# EAGLE schematic Shield-Proteco (EAGLE 9.1.0)
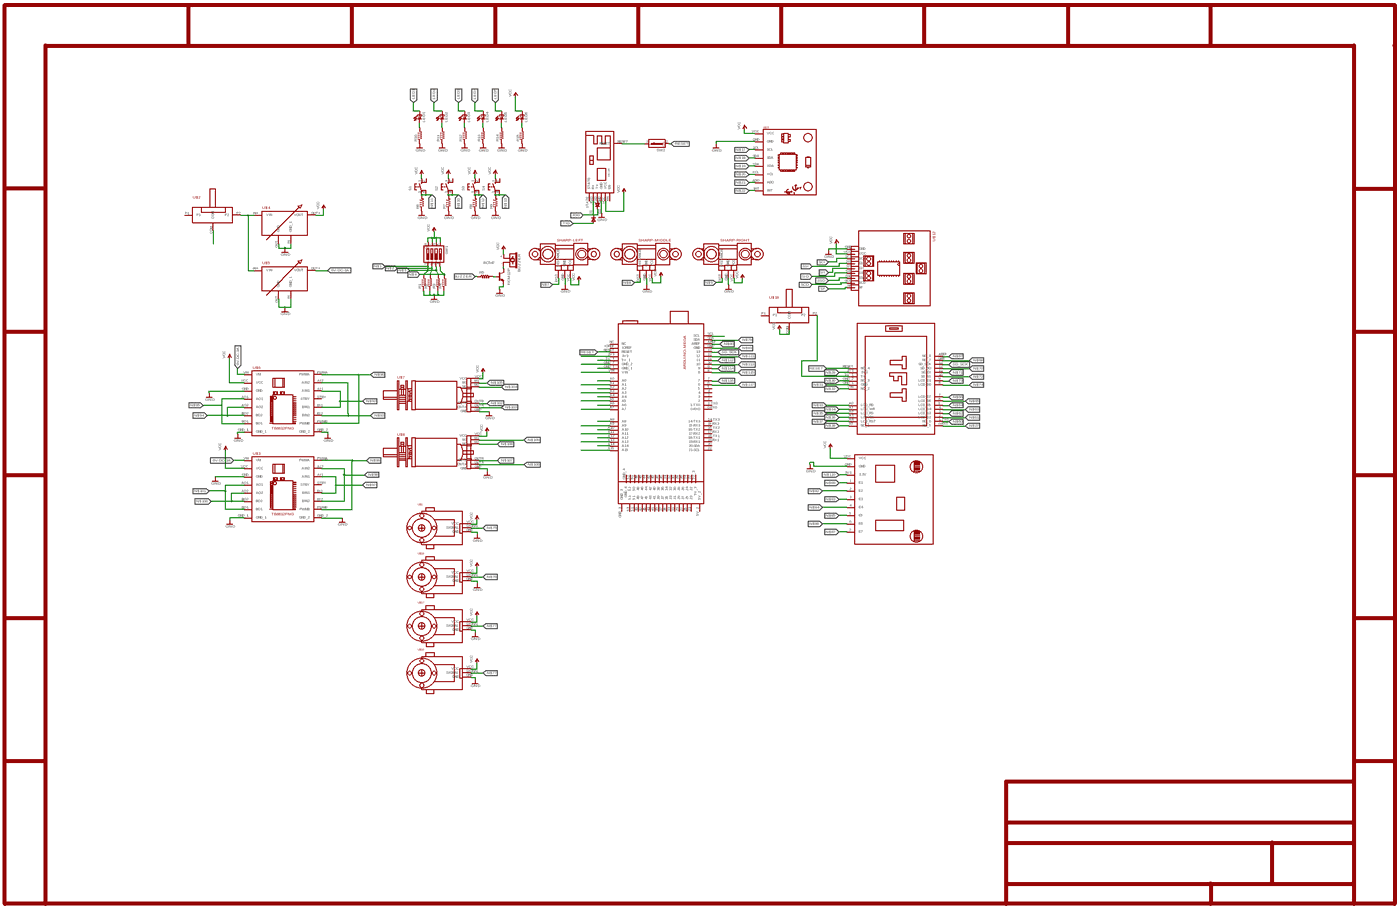
[diagram p0: schematic, sheet 1, overview]
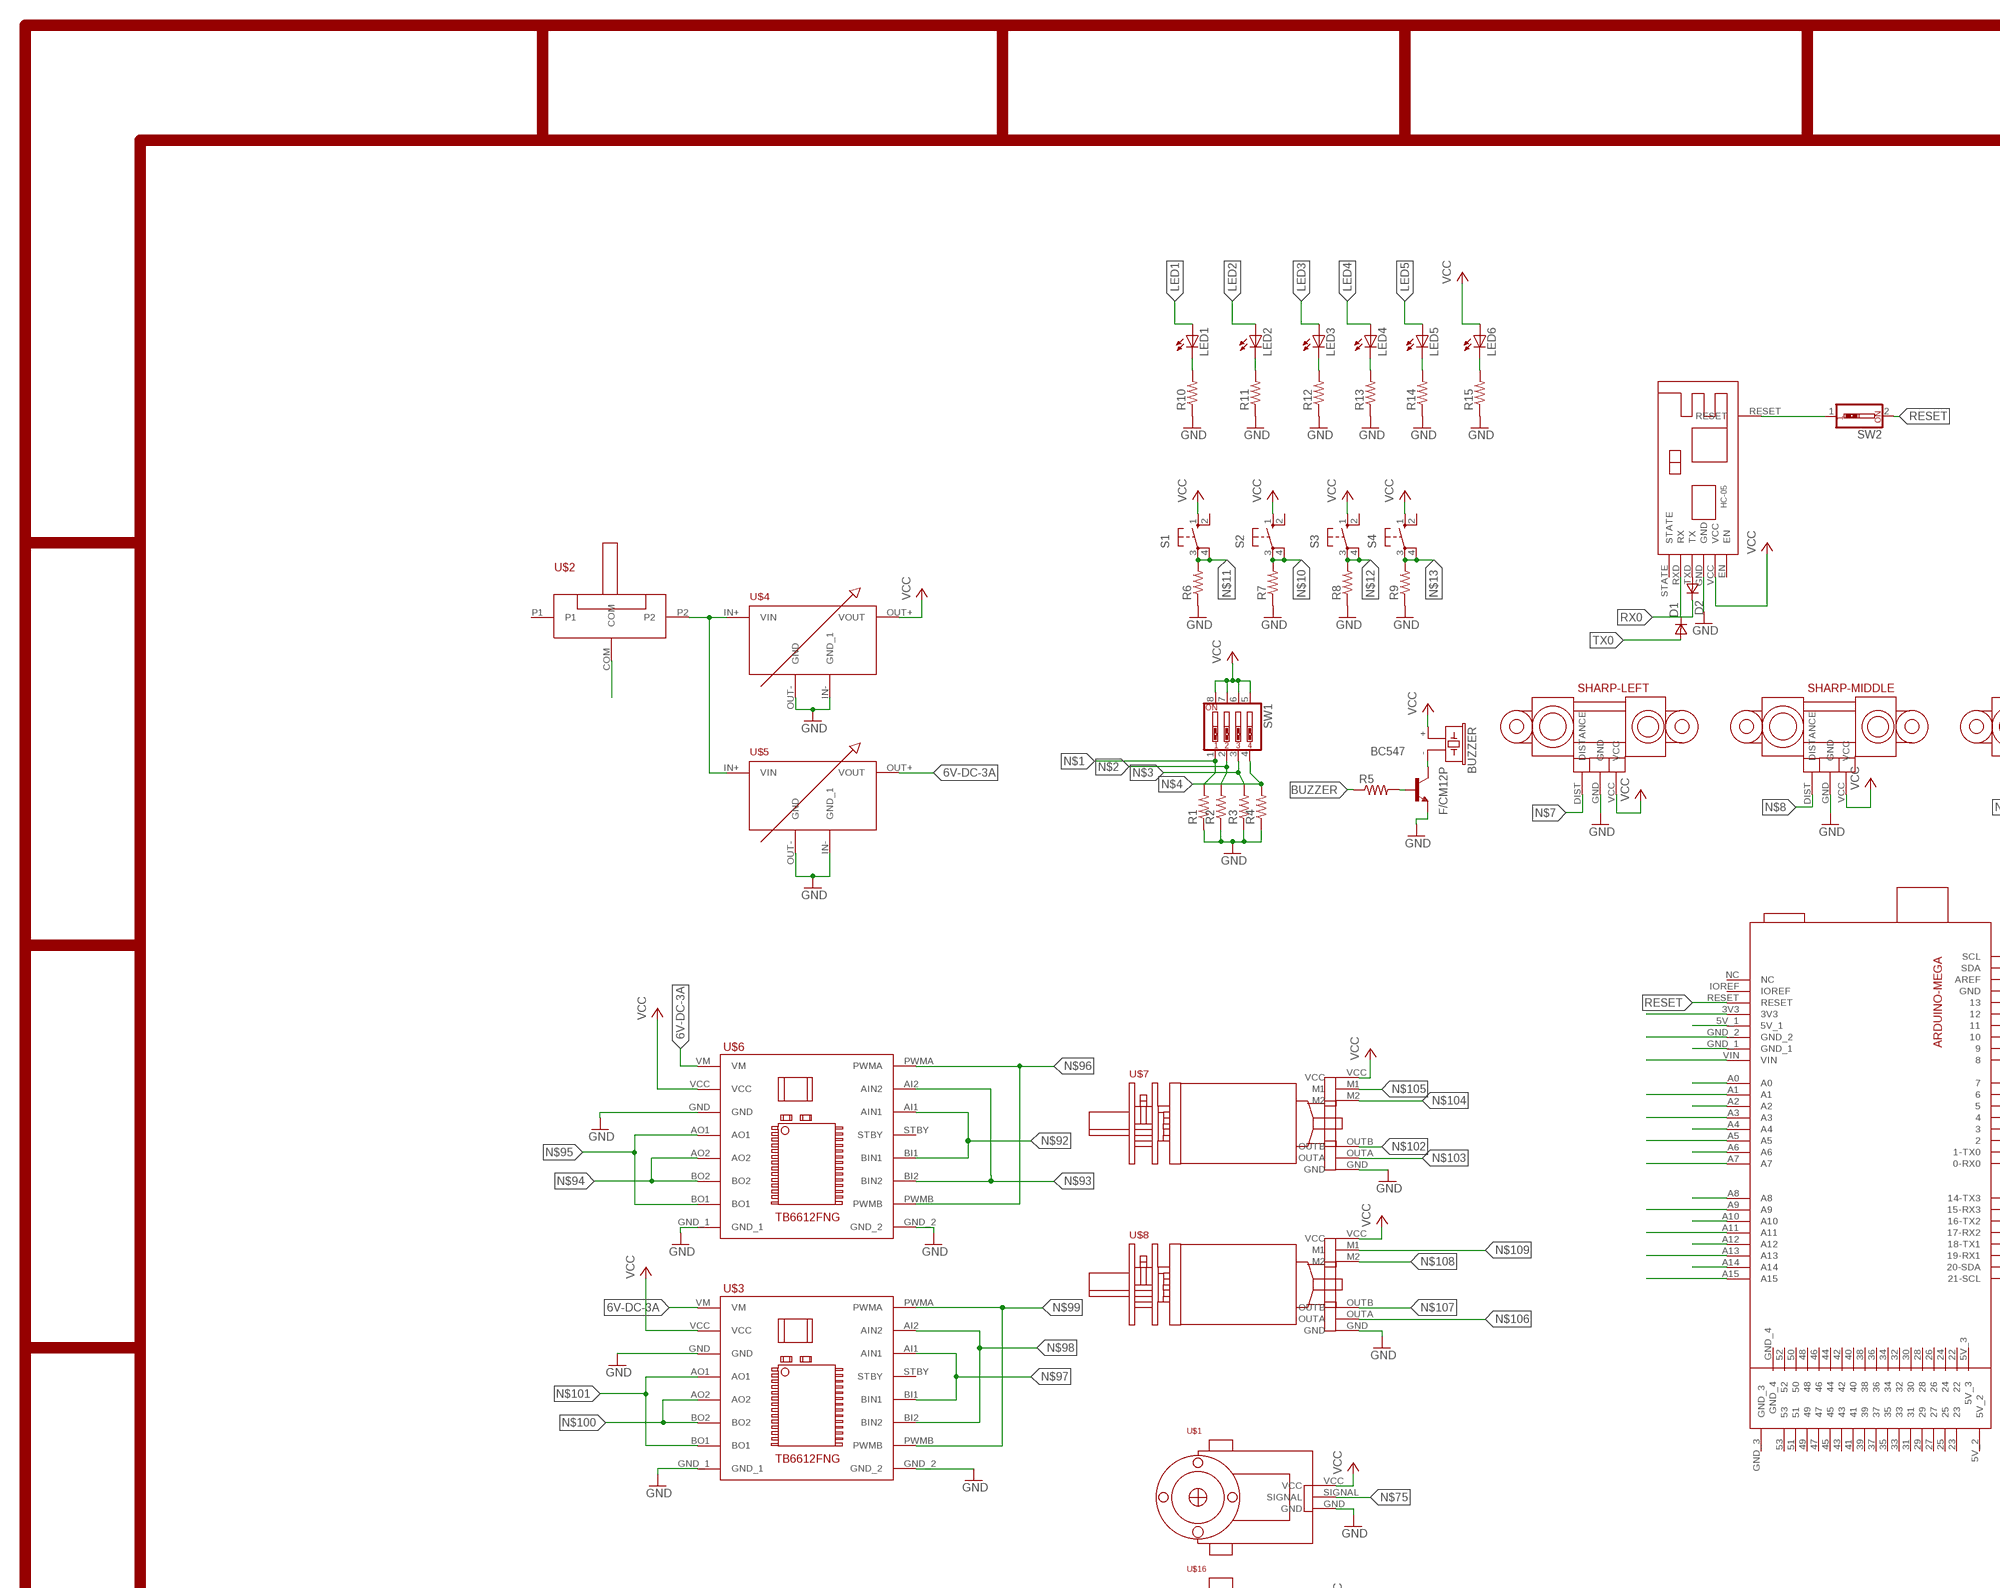
[diagram p1: schematic, sheet 1, part 1 of 4]
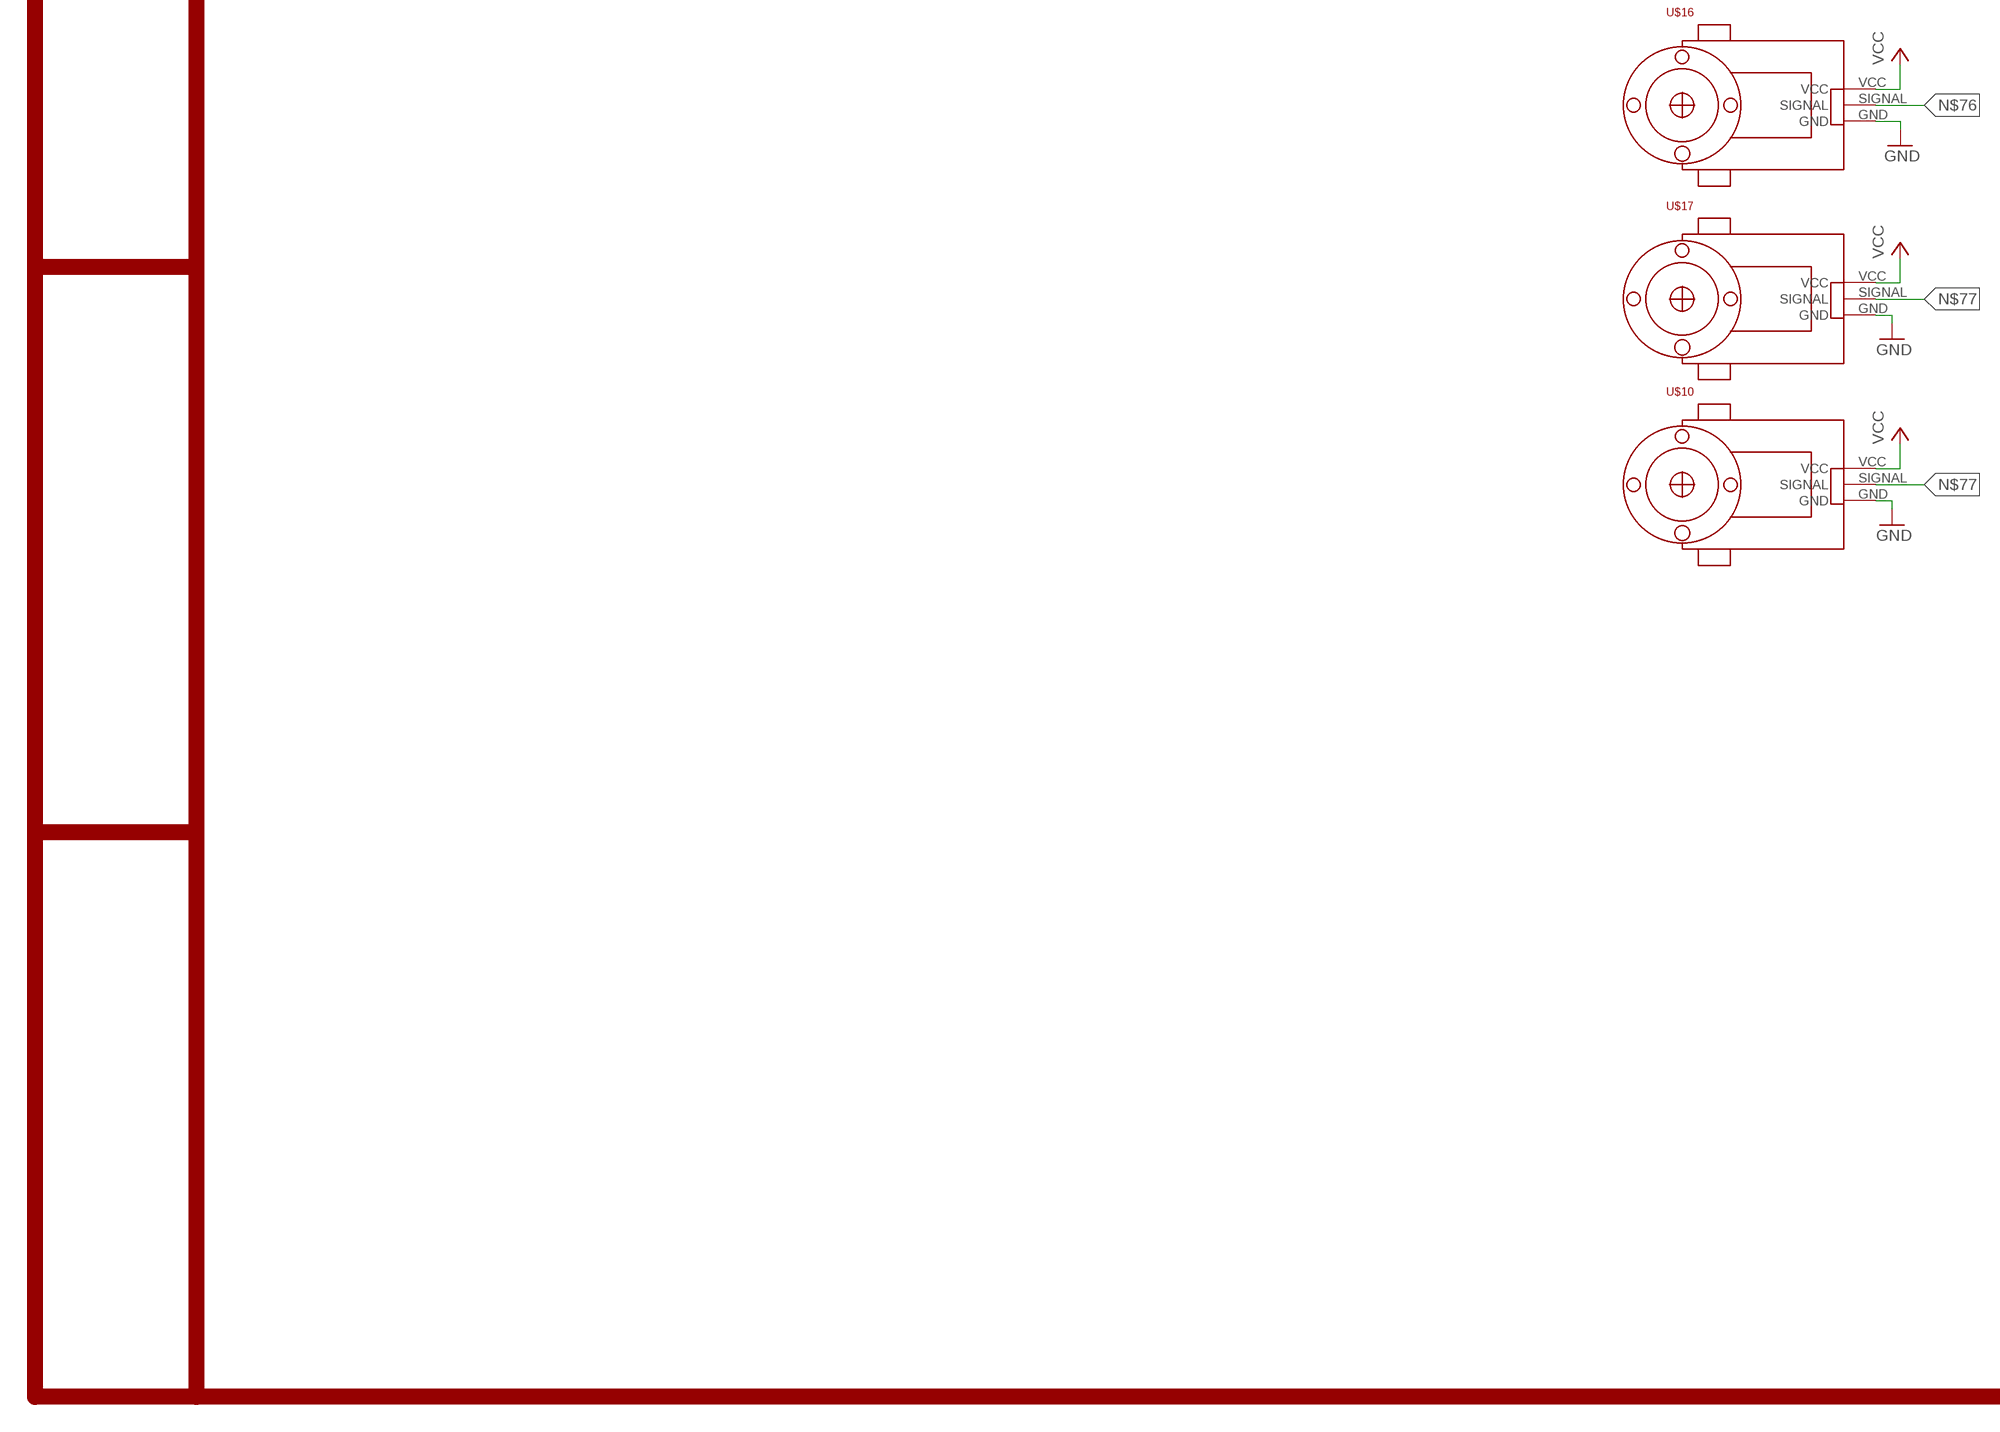
[diagram p2: schematic, sheet 1, part 2 of 4]
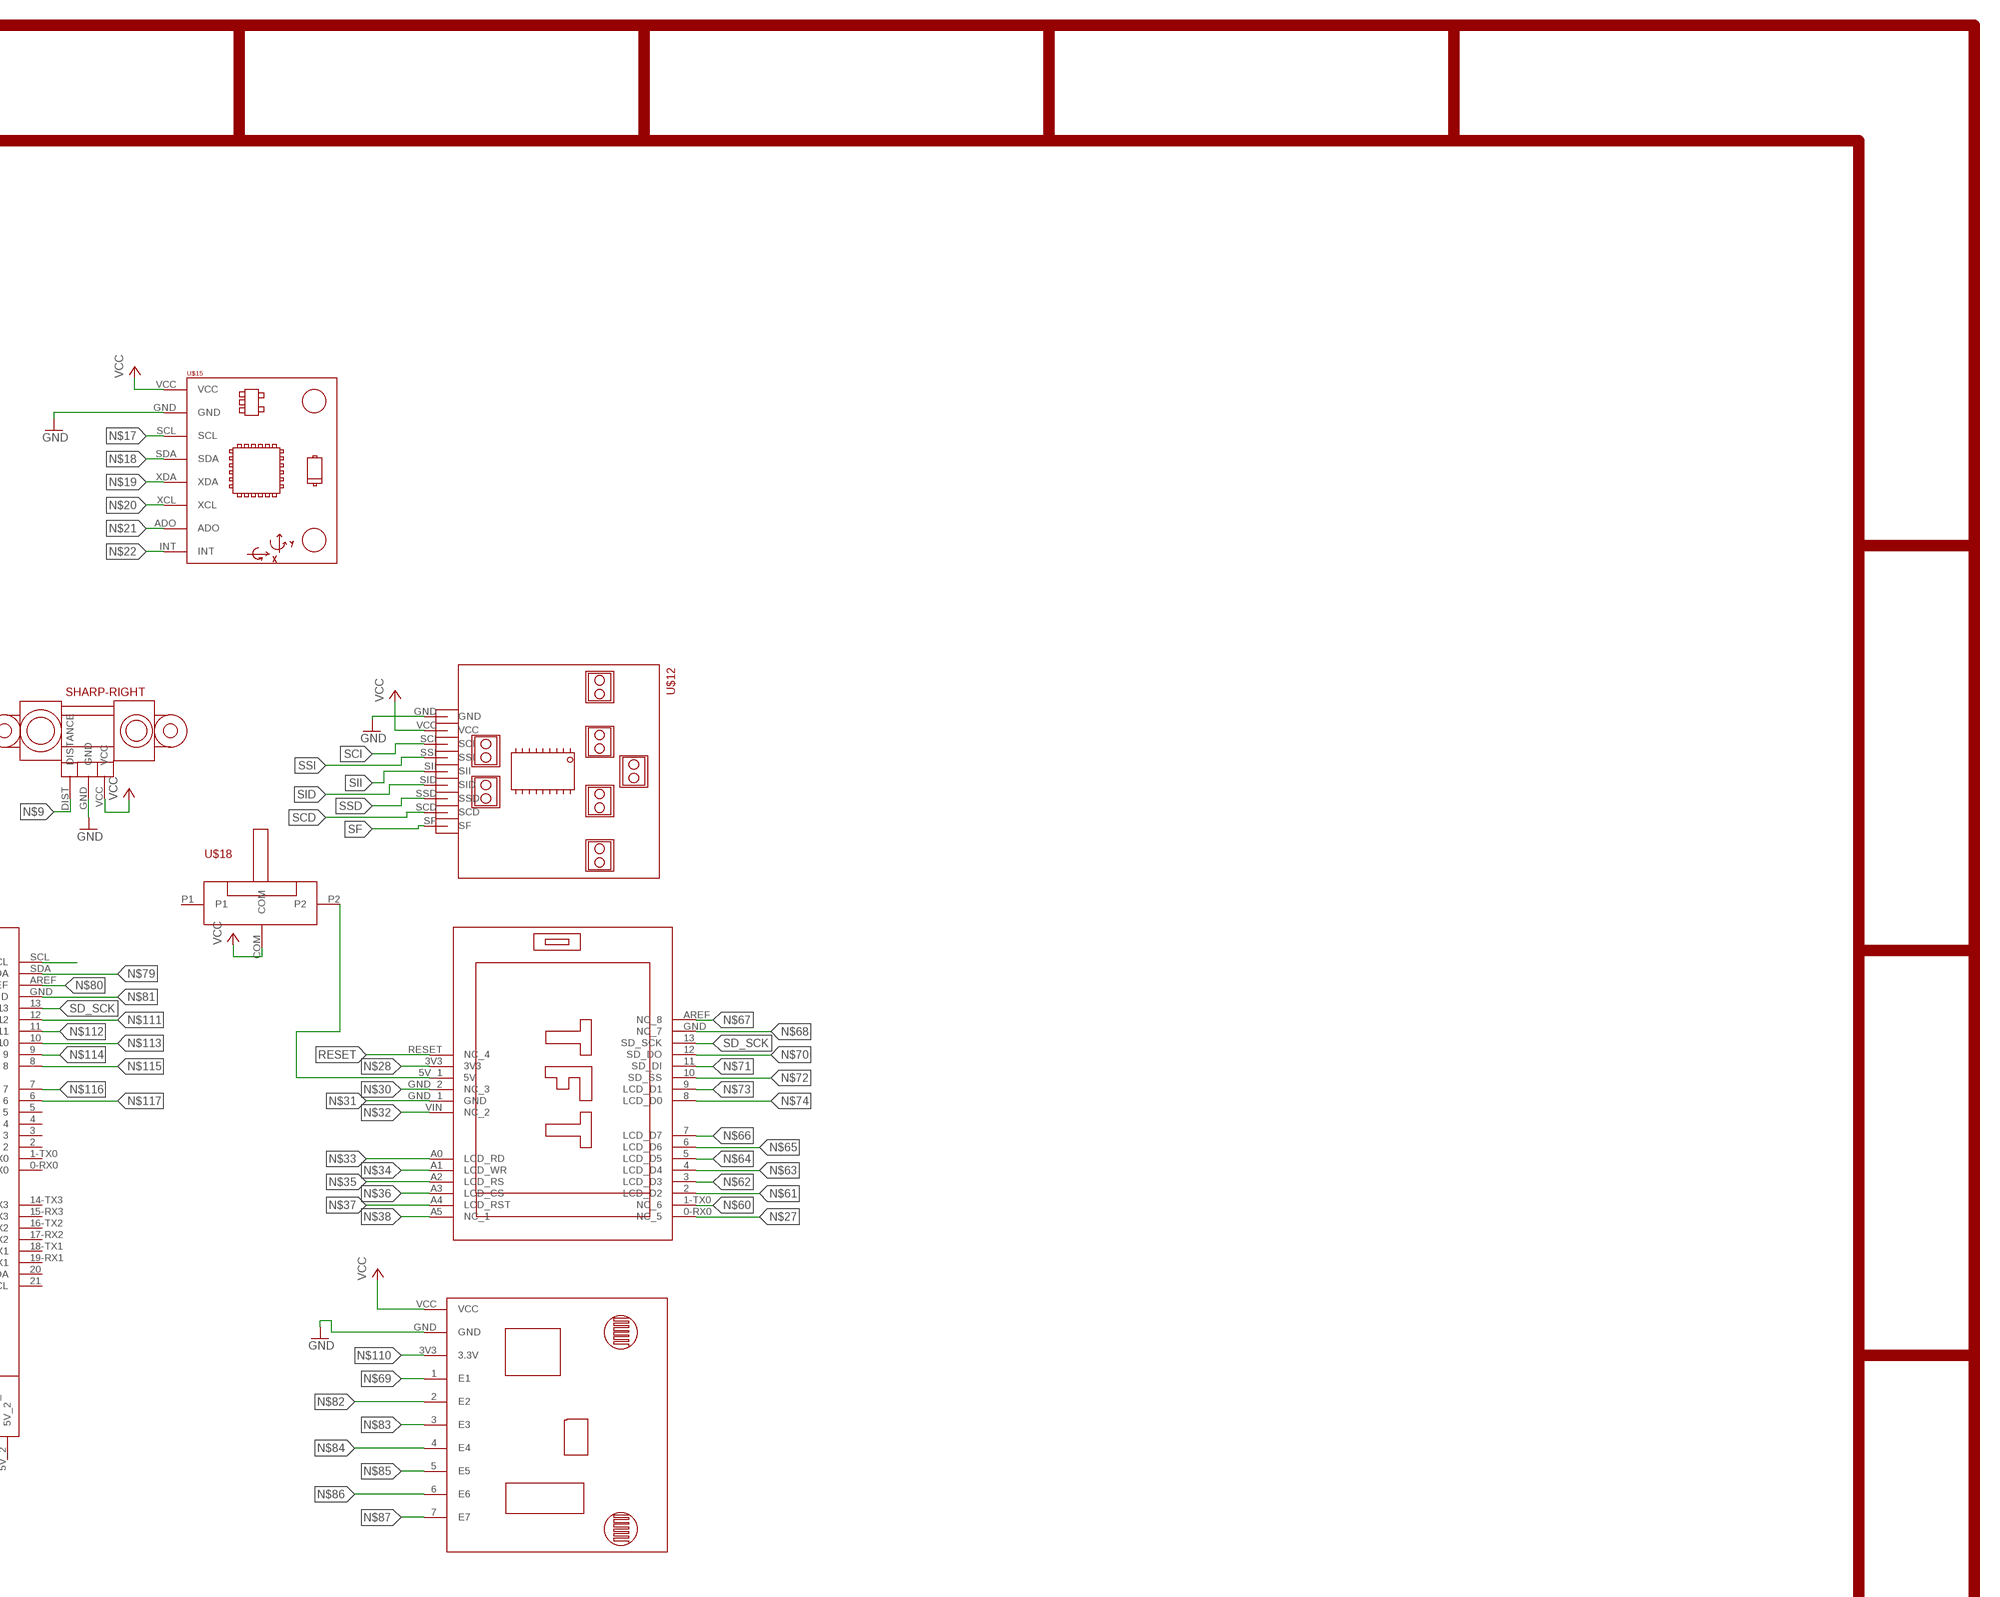
[diagram p3: schematic, sheet 1, part 3 of 4]
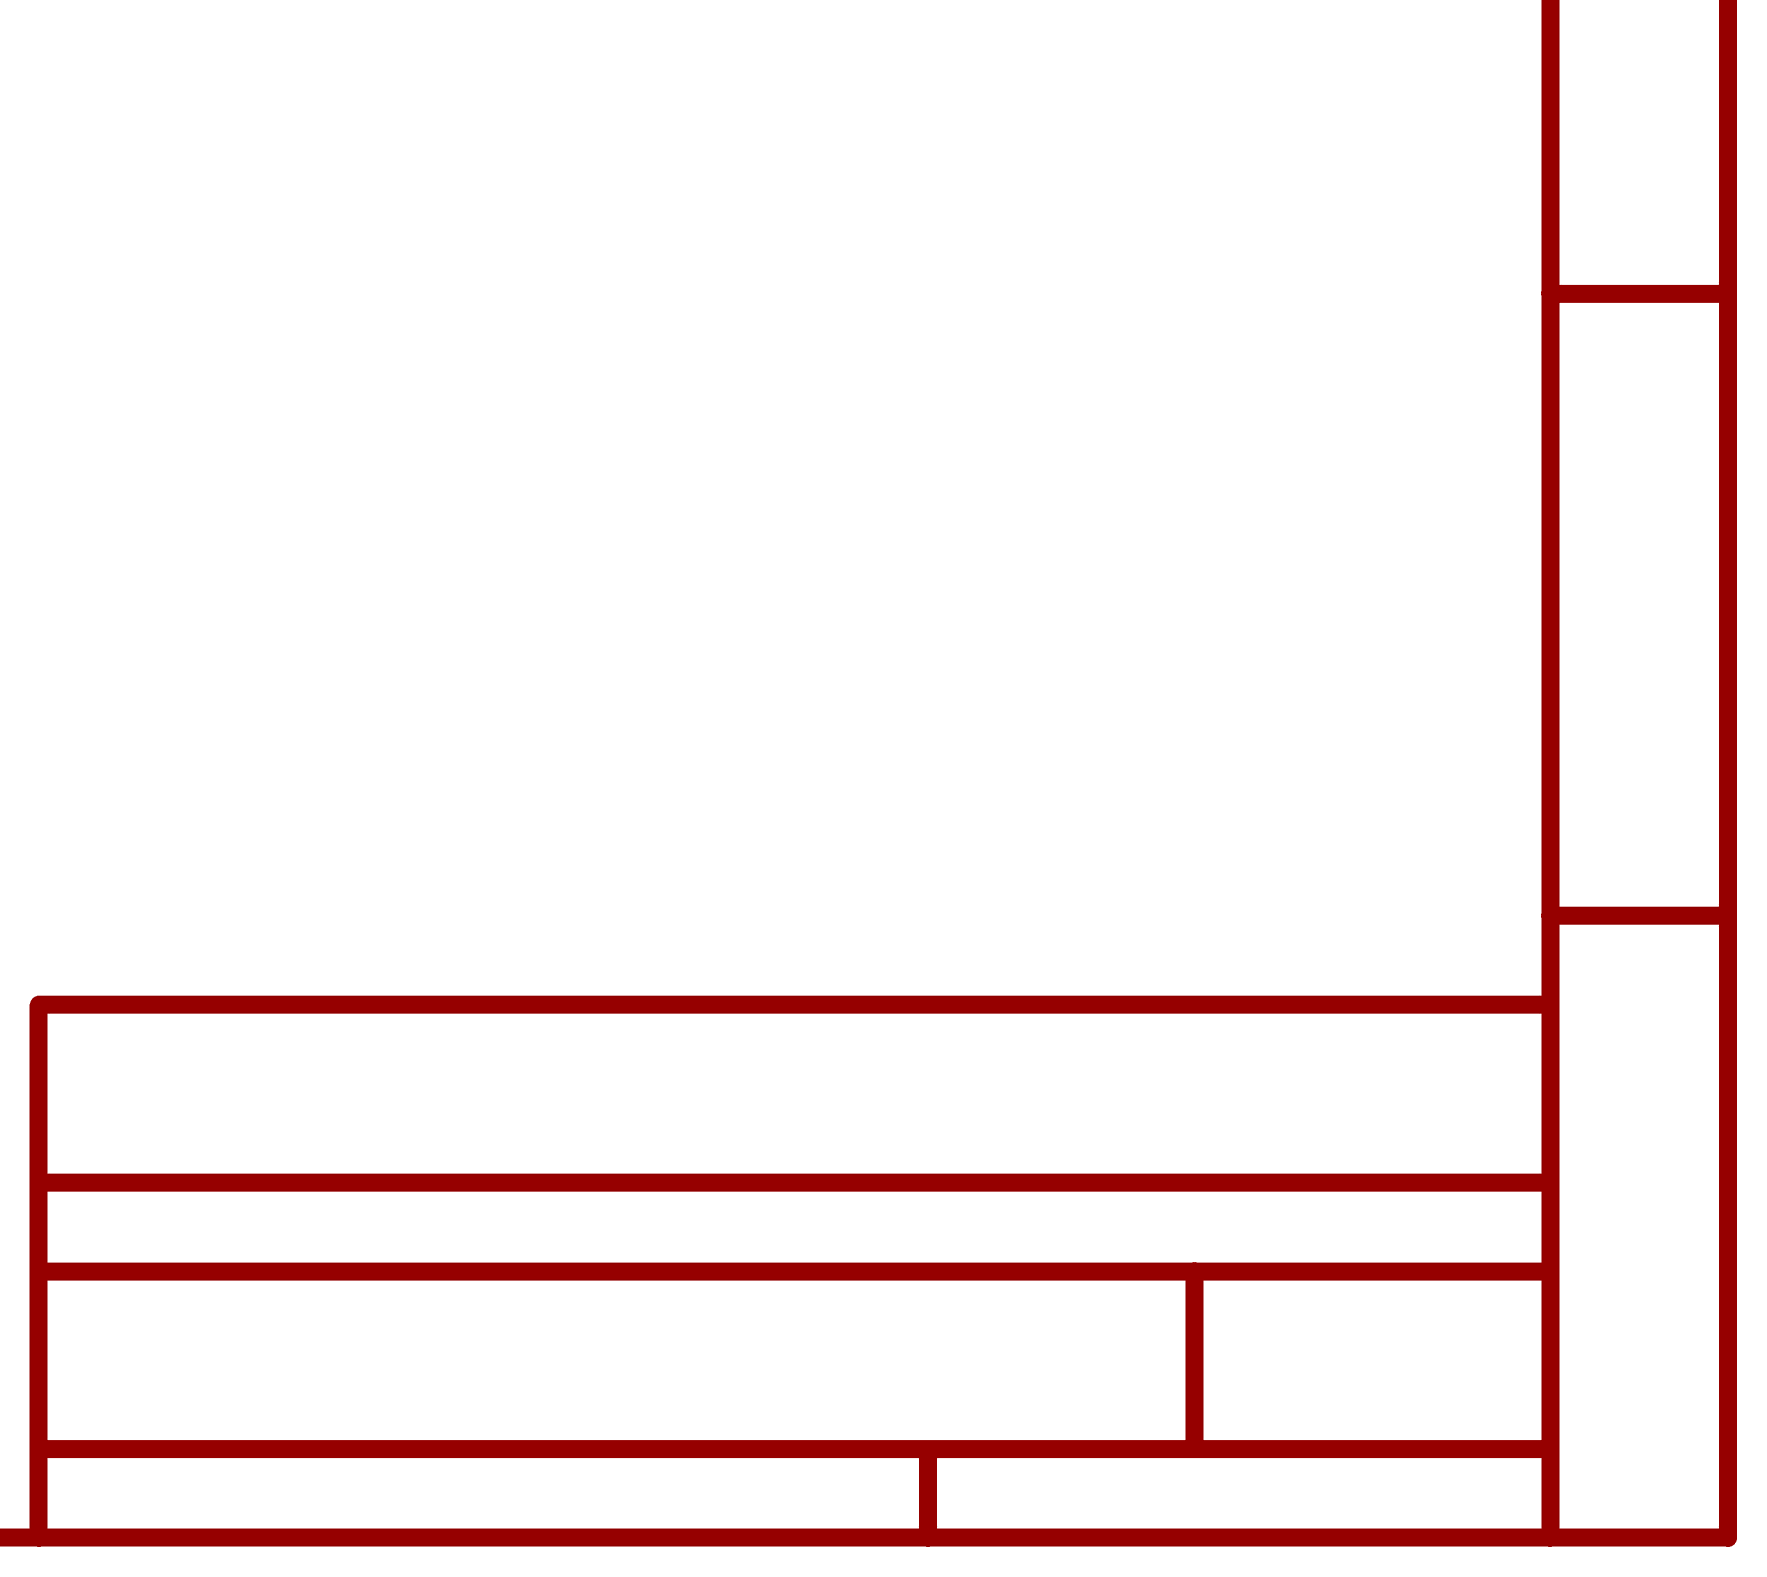
[diagram p4: schematic, sheet 1, part 4 of 4]

## Parts
ARDUINO-MEGA  ARDUINO_MEGA  [ARDUINO-MEGA]
BC547  BC547-NPN-TO92-CBE  [TO92-CBE]
BUZZER  F/CM12P  [F/CM12P]
D1  DSOD323  [SOD323]
D2  DSOD323  [SOD323]
HC-05  HC-05-PROG  [HC-05-PROG]
LED1  LEDCHIPLED_1206  [CHIPLED_1206]
LED2  LEDCHIPLED_1206  [CHIPLED_1206]
LED3  LEDCHIPLED_1206  [CHIPLED_1206]
LED4  LEDCHIPLED_1206  [CHIPLED_1206]
LED5  LEDCHIPLED_1206  [CHIPLED_1206]
LED6  LEDCHIPLED_1206  [CHIPLED_1206]
R1  R-US_M1206  [M1206]
R2  R-US_M1206  [M1206]
R3  R-US_M1206  [M1206]
R4  R-US_M1206  [M1206]
R5  R-US_M1206  [M1206]
R6  R-US_M1206  [M1206]
R7  R-US_M1206  [M1206]
R8  R-US_M1206  [M1206]
R9  R-US_M1206  [M1206]
R10  R-US_M1206  [M1206]
R11  R-US_M1206  [M1206]
R12  R-US_M1206  [M1206]
R13  R-US_M1206  [M1206]
R14  R-US_M1206  [M1206]
R15  R-US_M1206  [M1206]
S1  10-XX  [B3F-10XX]
S2  10-XX  [B3F-10XX]
S3  10-XX  [B3F-10XX]
S4  10-XX  [B3F-10XX]
SHARP-LEFT  SHARP  [SHARP]
SHARP-MIDDLE  SHARP  [SHARP]
SHARP-RIGHT  SHARP  [SHARP]
SW1  SW_DIP-4  [EDG-04]
SW2  SW_DIP-1  [EDG-01]
U$1  SERVOMOTORES  [SERVO]
U$2  SLIDE-3  [SLIDE-3]
U$3  TB6612FNG  [TB6612FNG]
U$4  STEPDOWN-DC-DC  [STEPDOWN-DC-DC]
U$5  STEPDOWN-DC-DC  [STEPDOWN-DC-DC]
U$6  TB6612FNG  [TB6612FNG]
U$7  POLOLU-MICROMOTOR  [JST]
U$8  POLOLU-MICROMOTOR  [JST]
U$9  SENSOR-MISCELANEOUS  [SENSOR-MISCELANEOUS]
U$10  SERVOMOTORES  [SERVO]
U$12  CNY70-ARRAY  [CNY70-ARRAY]
U$14  TFT_ARDUINO-UNO-MEGA  [TFT-ARDUINO-UNO-MEGA]
U$15  ACELEROMETER-MPU6050-JST  [ACELEROMETER-MPU6050-JST]
U$16  SERVOMOTORES  [SERVO]
U$17  SERVOMOTORES  [SERVO]
U$18  SLIDE-3  [SLIDE-3]

## Nets
6V-DC-3A: U$3.VM U$5.OUT+(VOUT) U$6.VM
BUZZER: R5.1
GND: BC547.E HC-05.GND R1.1 R2.1 R3.1 R4.1 R6.1 R7.1 R8.1 R9.1 R10.1 R11.1 R12.1 R13.1 R14.1 R15.1 SHARP-LEFT.GND SHARP-MIDDLE.GND SHARP-RIGHT.GND U$1.GND U$3.GND U$3.GND_1 U$3.GND_2 U$4.IN-(GND_1) U$4.OUT-(GND) U$5.IN-(GND_1) U$5.OUT-(GND) U$6.GND U$6.GND_1 U$6.GND_2 U$7.GND U$8.GND U$9.GND U$10.GND U$12.GND U$15.GND U$16.GND U$17.GND
LED1: LED1.A
LED2: LED2.A
LED3: LED3.A
LED4: LED4.A
LED5: LED5.A
N$1: R1.2 SW1.1
N$2: R2.2 SW1.2
N$3: R3.2 SW1.3
N$4: R4.2 SW1.4
N$5: BC547.C BUZZER.-
N$6: BC547.B R5.2
N$7: SHARP-LEFT.DIST(DISTANCE)
N$8: SHARP-MIDDLE.DIST(DISTANCE)
N$9: SHARP-RIGHT.DIST(DISTANCE)
N$10: R7.2 S2.3(P) S2.4(P1)
N$11: R6.2 S1.3(P) S1.4(P1)
N$12: R8.2 S3.3(P) S3.4(P1)
N$13: R9.2 S4.3(P) S4.4(P1)
N$14: U$2.P2 U$4.IN+(VIN) U$5.IN+(VIN)
N$15: U$2.COM
N$16: HC-05.RESET SW2.1
N$17: U$15.SCL
N$18: U$15.SDA
N$19: U$15.XDA
N$20: U$15.XCL
N$21: U$15.ADO
N$22: U$15.INT
N$23: LED1.C R10.2
N$24: LED2.C R11.2
N$25: LED3.C R12.2
N$26: LED4.C R13.2
N$27: U$14.0-RX0(NC_5)
N$28: U$14.3V3
N$29: U$14.5V_1(5V) U$18.P2
N$30: U$14.GND_2(NC_3)
N$31: U$14.GND_1(GND)
N$32: U$14.VIN(NC_2)
N$33: U$14.A0(LCD_RD)
N$34: U$14.A1(LCD_WR)
N$35: U$14.A2(LCD_RS)
N$36: U$14.A3(LCD_CS)
N$37: U$14.A4(LCD_RST)
N$38: U$14.A5(NC_1)
N$39: ARDUINO-MEGA.3V3
N$40: ARDUINO-MEGA.5V_1
N$41: ARDUINO-MEGA.GND_2
N$42: ARDUINO-MEGA.GND_1
N$43: ARDUINO-MEGA.VIN
N$44: ARDUINO-MEGA.A0
N$45: ARDUINO-MEGA.A1
N$46: ARDUINO-MEGA.A2
N$47: ARDUINO-MEGA.A3
N$48: ARDUINO-MEGA.A4
N$49: ARDUINO-MEGA.A5
N$50: ARDUINO-MEGA.A6
N$51: ARDUINO-MEGA.A7
N$52: ARDUINO-MEGA.A8
N$53: ARDUINO-MEGA.A9
N$54: ARDUINO-MEGA.A10
N$55: ARDUINO-MEGA.A11
N$56: ARDUINO-MEGA.A12
N$57: ARDUINO-MEGA.A13
N$58: ARDUINO-MEGA.A14
N$59: ARDUINO-MEGA.A15
N$60: U$14.1-TX0(NC_6)
N$61: U$14.2(LCD_D2)
N$62: U$14.3(LCD_D3)
N$63: U$14.4(LCD_D4)
N$64: U$14.5(LCD_D5)
N$65: U$14.6(LCD_D6)
N$66: U$14.7(LCD_D7)
N$67: U$14.AREF(NC_8)
N$68: U$14.GND(NC_7)
N$69: U$9.1(E1)
N$70: U$14.12(SD_DO)
N$71: U$14.11(SD_DI)
N$72: U$14.10(SD_SS)
N$73: U$14.9(LCD_D1)
N$74: U$14.8(LCD_D0)
N$75: U$1.SIGNAL
N$76: U$16.SIGNAL
N$77: U$10.SIGNAL U$17.SIGNAL
N$78: ARDUINO-MEGA.SCL
N$79: ARDUINO-MEGA.SDA
N$80: ARDUINO-MEGA.AREF
N$81: ARDUINO-MEGA.GND
N$82: U$9.2(E2)
N$83: U$9.3(E3)
N$84: U$9.4(E4)
N$85: U$9.5(E5)
N$86: U$9.6(E6)
N$87: U$9.7(E7)
N$88: LED5.C R14.2
N$89: LED6.C R15.2
N$90: D2.2(A) HC-05.TXD(TX)
N$91: D1.1(C) HC-05.RXD(RX)
N$92: U$6.AI1(AIN1) U$6.BI1(BIN1)
N$93: U$6.AI2(AIN2) U$6.BI2(BIN2)
N$94: U$6.AO2 U$6.BO2
N$95: U$6.AO1 U$6.BO1
N$96: U$6.PWMA U$6.PWMB
N$97: U$3.AI1(AIN1) U$3.BI1(BIN1)
N$98: U$3.AI2(AIN2) U$3.BI2(BIN2)
N$99: U$3.PWMA U$3.PWMB
N$100: U$3.AO2 U$3.BO2
N$101: U$3.AO1 U$3.BO1
N$102: U$7.OUTB
N$103: U$7.OUTA
N$104: U$7.M2
N$105: U$7.M1
N$106: U$8.OUTA
N$107: U$8.OUTB
N$108: U$8.M2
N$109: U$8.M1
N$110: U$9.3V3(3.3V)
N$111: ARDUINO-MEGA.12
N$112: ARDUINO-MEGA.11
N$113: ARDUINO-MEGA.10
N$114: ARDUINO-MEGA.9
N$115: ARDUINO-MEGA.8
N$116: ARDUINO-MEGA.7
N$117: ARDUINO-MEGA.6
RESET: ARDUINO-MEGA.RESET SW2.2 U$14.RESET(NC_4)
RX0: D2.1(C)
SCD: U$12.SCD
SCI: U$12.SCI
SD_SCK: ARDUINO-MEGA.13 U$14.13(SD_SCK)
SF: U$12.SF
SID: U$12.SID
SII: U$12.SII
SSD: U$12.SSD
SSI: U$12.SSI
TX0: D1.2(A)
VCC: BUZZER.+ HC-05.VCC LED6.A S1.1(S) S2.1(S) S3.1(S) S4.1(S) SHARP-LEFT.VCC SHARP-MIDDLE.VCC SHARP-RIGHT.VCC SW1.5 SW1.6 SW1.7 SW1.8 U$1.VCC U$3.VCC U$4.OUT+(VOUT) U$6.VCC U$7.VCC U$8.VCC U$9.VCC U$10.VCC U$12.VCC U$15.VCC U$16.VCC U$17.VCC U$18.COM
Unconnected: ARDUINO-MEGA.0-RX0 ARDUINO-MEGA.1-TX0 ARDUINO-MEGA.2 ARDUINO-MEGA.3 ARDUINO-MEGA.4 ARDUINO-MEGA.5 ARDUINO-MEGA.5V_2 ARDUINO-MEGA.5V_3 ARDUINO-MEGA.14-TX3 ARDUINO-MEGA.15-RX3 ARDUINO-MEGA.16-TX2 ARDUINO-MEGA.17-RX2 ARDUINO-MEGA.18-TX1 ARDUINO-MEGA.19-RX1 ARDUINO-MEGA.20(20-SDA) ARDUINO-MEGA.21(21-SCL) ARDUINO-MEGA.22 ARDUINO-MEGA.23 ARDUINO-MEGA.24 ARDUINO-MEGA.25 ARDUINO-MEGA.26 ARDUINO-MEGA.27 ARDUINO-MEGA.28 ARDUINO-MEGA.29 ARDUINO-MEGA.30 ARDUINO-MEGA.31 ARDUINO-MEGA.32 ARDUINO-MEGA.33 ARDUINO-MEGA.34 ARDUINO-MEGA.35 ARDUINO-MEGA.36 ARDUINO-MEGA.37 ARDUINO-MEGA.38 ARDUINO-MEGA.39 ARDUINO-MEGA.40 ARDUINO-MEGA.41 ARDUINO-MEGA.42 ARDUINO-MEGA.43 ARDUINO-MEGA.44 ARDUINO-MEGA.45 ARDUINO-MEGA.46 ARDUINO-MEGA.47 ARDUINO-MEGA.48 ARDUINO-MEGA.49 ARDUINO-MEGA.50 ARDUINO-MEGA.51 ARDUINO-MEGA.52 ARDUINO-MEGA.53 ARDUINO-MEGA.GND_3 ARDUINO-MEGA.GND_4 ARDUINO-MEGA.IOREF ARDUINO-MEGA.NC HC-05.EN HC-05.STATE S1.2(S1) S2.2(S1) S3.2(S1) S4.2(S1) U$2.P1 U$3.STBY U$6.STBY U$18.P1

## Library data of the parts
ARDUINO-MEGA = Arduino:ARDUINO_MEGA: El Arduino MEGA 2560 está diseñado para proyectos que requieren más líneas de E / S, más memoria de boceto y más RAM. Con 54 pines de E / S digitales, 16 entradas analógicas y un espacio más grande para su boceto, es la placa recomendada para impresoras 3D y proyectos de robótica. Microcontrolador: ATmega2560 Voltaje Operativo: 5V Voltaje de Entrada: 7-12V Voltaje de Entrada(límites): 6-20V Pines digitales de Entrada/Salida: 54 (de los cuales 15 proveen salida PWM) Pines análogos de entrada: 16 Corriente DC por cada Pin Entrada/Salida: 40 mA Corriente DC entregada en el Pin 3.3V: 50 mA Memoria Flash: 256 KB (8KB usados por el bootloader) SRAM: 8KB EEPROM: 4KB Clock Speed: 16 MHz
BC547 = transistor:*-NPN-: NPN Transistror BF959 corrected 2008.03.06
BUZZER = buzzer:F/CM12P: BUZZER Source: Buerklin; OC_FARNELL: unknown; OC_NEWARK: unknown
D1 D2 = zetex:D: DIODE; MPN: CDSOD323-T05C; OC_FARNELL: 1824860; OC_NEWARK: 79R6078
HC-05 = hc-xx:HC-05-PROG: Con funcion adicional para programar arduino remotamente. HC-05 module is an easy to use Bluetooth SPP (Serial Port Protocol) module, designed for transparent wireless serial connection setup. Serial port Bluetooth module is fully qualified Bluetooth V2.0+EDR (Enhanced Data Rate) 3Mbps Modulation with complete 2.4GHz radio transceiver and baseband. It uses CSR Bluecore 04-External single chip Bluetooth system with CMOS technology and with AFH(Adaptive Frequency Hopping Feature). It has the footprint as small as 12.7mmx27mm. Hope it will simplify your overall design/development cycle.
LED1-LED6 = led:LED: LED OSRAM: - CHIPLED LG R971, LG N971, LY N971, LG Q971, LY Q971, LO R971, LY R971 LH N974, LH R974 LS Q976, LO Q976, LY Q976 LO Q996 - Hyper CHIPLED LW Q18S LB Q993, LB Q99A, LB R99A - SideLED LS A670, LO A670, LY A670, LG A670, LP A670 LB A673, LV A673, LT A673, LW A673 LH A674 LY A675 LS A676, LA A676, LO A676, LY A676, LW A676 LS A679, LY A679, LG A679 - Hyper Micro SIDELED® LS Y876, LA Y876, LO Y876, LY Y876 LT Y87S - SmartLED LW L88C, LW L88S LB L89C, LB L89S, LG L890 LS L89K, LO L89K, LY L89K LS L896, LA L896, LO L896, LY L896 - TOPLED LS T670, LO T670, LY T670, LG T670, LP T670 LSG T670, LSP T670, LSY T670, LOP T670, LYG T670 LG T671, LOG T671, LSG T671 LB T673, LV T673, LT T673, LW T673 LH T674 LS T676, LA T676, LO T676, LY T676, LB T676, LH T676, LSB T676, LW T676 LB T67C, LV T67C, LT T67C, LS T67K, LO T67K, LY T67K, LW E67C LS E67B, LA E67B, LO E67B, LY E67B, LB E67C, LV E67C, LT E67C LW T67C LS T679, LY T679, LG T679 LS T770, LO T770, LY T770, LG T770, LP T770 LB T773, LV T773, LT T773, LW T773 LH T774 LS E675, LA E675, LY E675, LS T675 LS T776, LA T776, LO T776, LY T776, LB T776 LHGB T686 LT T68C, LB T68C - Hyper Mini TOPLED® LB M676 - Mini TOPLED Santana® LG M470 LS M47K, LO M47K, LY M47K Source: http://www.osram.convergy.de LUXEON: - LUMILED® LXK2-PW12-R00, LXK2-PW12-S00, LXK2-PW14-U00, LXK2-PW14-V00 LXK2-PM12-R00, LXK2-PM12-S00, LXK2-PM14-U00 LXK2-PE12-Q00, LXK2-PE12-R00, LXK2-PE12-S00, LXK2-PE14-T00, LXK2-PE14-U00 LXK2-PB12-K00, LXK2-PB12-L00, LXK2-PB12-M00, LXK2-PB14-N00, LXK2-PB14-P00, LXK2-PB14-Q00 LXK2-PR12-L00, LXK2-PR12-M00, LXK2-PR14-Q00, LXK2-PR14-R00 LXK2-PD12-Q00, LXK2-PD12-R00, LXK2-PD12-S00 LXK2-PH12-R00, LXK2-PH12-S00 LXK2-PL12-P00, LXK2-PL12-Q00, LXK2-PL12-R00 Source: www.luxeon.com KINGBRIGHT: KA-3528ASYC Source: www.kingbright.com
R1-R15 = rcl:R-US_: RESISTOR, American symbol; SPICEPREFIX: R
S1-S4 = switch-omron:10-XX: OMRON SWITCH; MPN: B3F-1000; OC_FARNELL: 176432; OC_NEWARK: 36M3542
SHARP-LEFT SHARP-MIDDLE SHARP-RIGHT = Sensores:SHARP
SW1 = special:SW_DIP-4: DIP SWITCH
SW2 = special:SW_DIP-1: DIP SWITCH
U$1 U$10 U$16 U$17 = Motores:SERVOMOTORES: Servomotor normal
U$2 U$18 = Interruptores:SLIDE-3: Interruptor deslizante de uso fácil
U$3 U$6 = Driver-Motor:TB6612FNG: https://www.pololu.com/product/713 Esta pequeña placa es una forma fácil de usar el controlador de motor dual TB6612FNG de Toshiba, que puede controlar de forma independiente dos motores de CC bidireccionales o un motor paso a paso bipolar. Una tensión de motor recomendada de 4.5 V a 13.5 V y una salida de corriente pico de 3 A por canal (1 A continuo) hacen de este un excelente controlador de motor para motores de baja potencia.
U$4 U$5 = Reguladores:STEPDOWN-DC-DC: Fuente conmutada tipo stepdown Vin [4.5 a 28V] Vot [0.8 a 20V] Corriente Maxima: 3A Eficiencia de Conversion maxima = 96% frecuencia de conmutacion 15MHz maxima, 1MHz tipica
U$7 U$8 = Motores:POLOLU-MICROMOTOR: Este motorreductor es un motor de CC de 6 V con escobillas de alta potencia en miniatura , con escobillas de carbón de larga duración y una caja de engranajes de metal de 51.45: 1 . Tiene una sección transversal de 10 × 12 mm y el eje de salida de la caja de engranajes en forma de D tiene 9 mm de largo y 3 mm de diámetro 6 V 650 RPM, 100 mA 0.74 kg⋅cm (10 oz⋅in), 1.5 A Agregue codificadores de cuadratura a sus motorreductores de metal, MP o HP (se requiere una versión con eje trasero extendido) con este kit que utiliza un disco magnético y sensores de efecto hall para proporcionar 12 conteos por revolución del eje del motor. Los sensores funcionan de 2.7 V a 18 V y proporcionan salidas digitales que se pueden conectar directamente a un microcontrolador u otro circuito digital. Nota: esta versión no es compatible con los motorreductores de metal micro HPCB; Solo es compatible con motorreductores de metal micro LP, MP y HP de doble eje. https://www.pololu.com/product/2598
U$9 = Sensores:SENSOR-MISCELANEOUS: Módulo con sensores que se agregaran mas tarde si son necesarios
U$12 = Sensores:CNY70-ARRAY: Arreglo de sensores reflexivos para seguimiento de linea, señal digital de 1 cm a 1.5 cm. SCI ->Sensor Central Izquierdo ; SSI ->Sensor Superior Izquierdo ; SII ->Sensor Inferior Izquierdo ; SID ->Sensor Inferior Derecho ; SSD ->Sensor Superior Derecho ; SCD ->Sensor Central Derecho ; SF -> Sensor Frontal;
U$14 = TFT:TFT_ARDUINO-UNO-MEGA: Pantalla LCD TFT de 2,4” Chip controlador LCD ILI9341 (Enlace para descargar el Datasheet ILI9341) 320×240 pixeles de resolución y 262.000 colores Panel táctil resistivo de 4 hilos Compatible con tensión de 5V ya que dispone de regulador de tensión en placa Conexión Shield para Arduino UNO Tamaño: 71 x 52 x 7 mm (L x A x H)
U$15 = Sensores:ACELEROMETER-MPU6050-JST: Giroscopio de tres ejes y acelerómetro de tres ejes. Fuente de alimentación: 4.3 a 9 V ( regulador de abandono bajo KB33 incorporado ) Modos de comunicación: protocolo de comunicaciones estándar IIC (I2C) Chip incorporado 16 bit ADC convertidor, salida de datos de 16 bits Rango del giroscopio: +/- 250, +/- 500, +/- 1000, +/- 2000 ° / s Rango de aceleración: +/- 2g, +/- 4g, +/- 8g, +/- 16g Dimensiones (excluyendo los pasadores): 21.2 mm (0.84 ") de longitud x 16.4 mm (0.65") de ancho x 3.3 mm (0.13 ") de altura Peso: 2.1g (0.07 oz)